# Altium schematic sheet Snippet_ATmega32A.SchDoc
size 840 x 594 mm
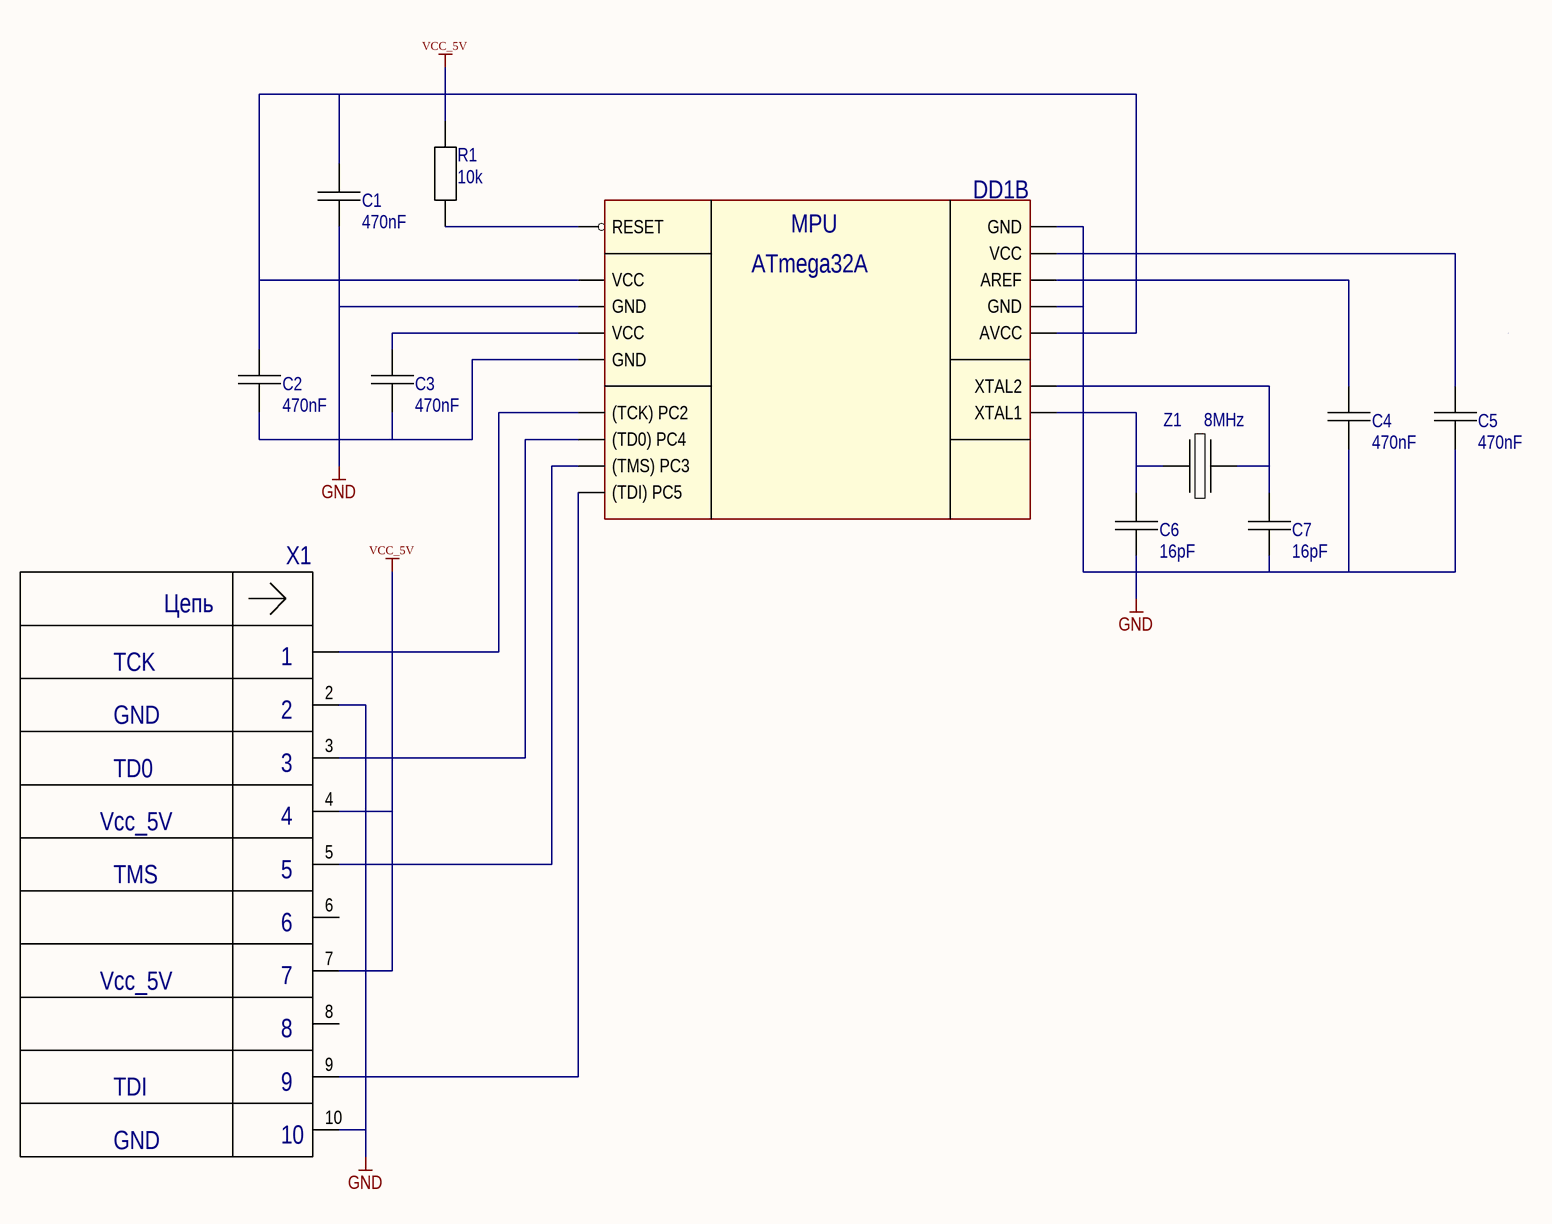
[diagram p0: Snippet_ATmega32A.SchDoc]

## Parts
C1  470nF  [Capacitor_0805]
C2  470nF  [Capacitor_0805]
C3  470nF  [Capacitor_0805]
C4  470nF  [Capacitor_0805]
C5  470nF  [Capacitor_0805]
C6  16pF  [Capacitor_0805]
C7  16pF  [Capacitor_0805]
DD1  ATmega32A_TQFP  [ATmega32A_TQFP44]  (value not drawn)  (part B of 2)
R1  10k  [RESISTOR_SMD0805]
X1  Connector_PLD-10  [CONNECTOR_PLD-10]  (value not drawn)
Z1  8MHz  [Quartz_KX-9]

## Nets
GND: C1.2 C2.1 C3.1 C4.1 C5.1 C6.2 C7.2 DD1.6(GND) DD1.18(GND) DD1.28(GND) DD1.39(GND) X1.2 X1.10
VCC_5V: C1.1 C2.2 C4.2 C5.2 DD1.5(VCC) DD1.27(AVCC) DD1.29(AREF) DD1.38(VCC) R1.2 X1.4 X1.7
NetC3_2: C3.2 DD1.17(VCC)
NetC6_1: C6.1 DD1.8(XTAL1) Z1.1
NetC7_1: C7.1 DD1.7(XTAL2) Z1.3
NetDD1_4: DD1.4(RESET) R1.1
NetDD1_21: DD1.21((TCK)_PC2) X1.1
NetDD1_22: DD1.22((TMS)_PC3) X1.5
NetDD1_23: DD1.23((TD0)_PC4) X1.3
NetDD1_24: DD1.24((TDI)_PC5) X1.9

Not connected (* = marked no-connect by the designer): X1 6 8

## Notes on the sheet
- GND
- TCK
- TD0
- Vcc_5V
- TMS
- TDI
- (in symbol ATmega32A_TQFP, part B) MPU; ATmega32A
- (in symbol Connector_PLD-10) Цепь

## Library data of the parts
C1-C7 = Capacitor_0805
R1 = Resistor_0805
Z1 = Quartz_KX-9A